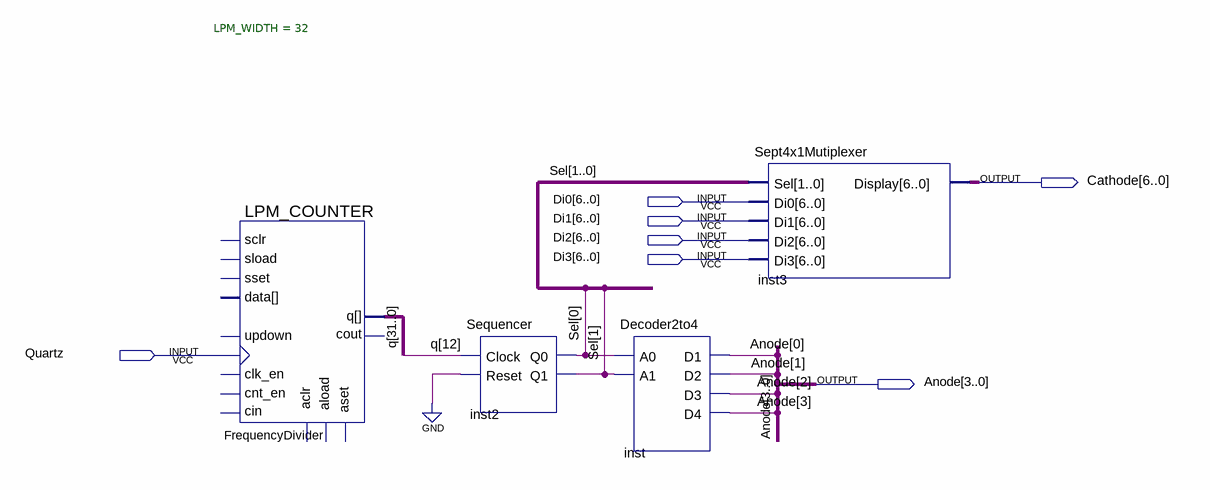
[diagram p0: schematic sheet]
// Quartus schematic FourDigitSSD.bdf as structural Verilog: 4 symbols, 7 pins
module FourDigitSSD (
  input  [6:0] Di0,
  input  [6:0] Di1,
  input  [6:0] Di2,
  input  [6:0] Di3,
  input  Quartz,
  output [6:0] Cathode,
  output [3:0] Anode
);

  wire [1:0] Sel;
  wire [31:0] q;

  LPM_COUNTER #(.LPM_WIDTH(32)) FrequencyDivider (
    .clock(Quartz), .q(q));  // open: sload, data, clk_en, aload, aclr, aset, cin, sset, updown, cnt_en, sclr, cout
  Sequencer inst2 (.Clock(q[12]), .Reset(1'b0), .Q0(Sel[0]), .Q1(Sel[1]));
  Decoder2to4 inst (.A0(Sel[0]), .A1(Sel[1]), .D1(Anode[0]), .D2(Anode[1]), .D3(Anode[2]), .D4(Anode[3]));
  Sept4x1Mutiplexer inst3 (.Sel(Sel), .Di0(Di0), .Di1(Di1), .Di2(Di2), .Di3(Di3), .Display(Cathode));
endmodule
